# Altium project MPU-6050_Main_Project.PrjPcb
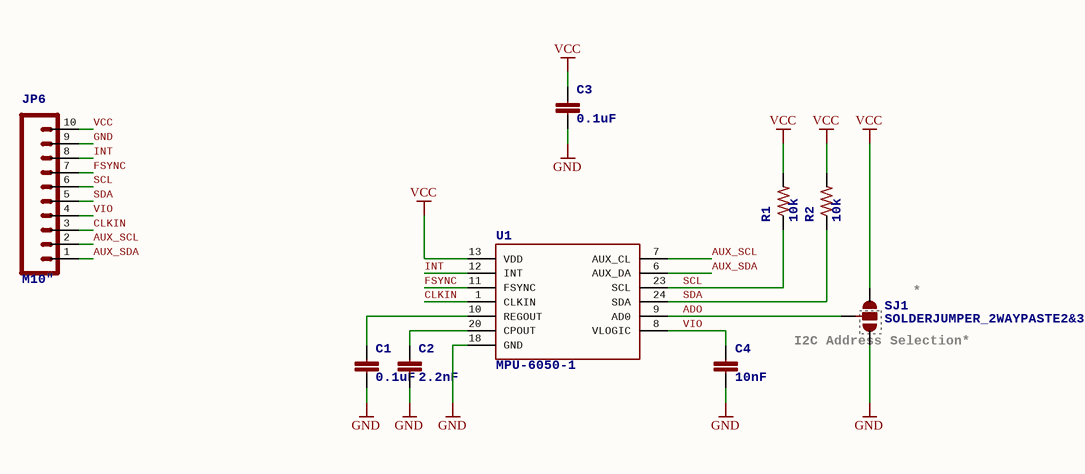
[diagram p0: MPU-6050_Main_SCH.SchDoc]
1 sheet, 9 parts. Net scope: global (net labels, ports and power ports of the same name join across sheets).
Board file: MPU-6050_Main_PCB.PcbDoc

## Sheet MPU-6050_Main_SCH.SchDoc: TITLE:
size A4; Date: Date:

### Parts
C1  >NAME: C1  [0603-CAP]  (hidden comment: 0.1uF)
C2  >NAME: C2  [0603-CAP]  (hidden comment: 2.2nF)
C3  >NAME: C3  [0603-CAP]  (hidden comment: 0.1uF)
C4  >NAME: C4  [0603-CAP]  (hidden comment: 10nF)
JP6  >NAME: JP6  [1X10]  (hidden comment: M10")
R1  >NAME: R1  [0603-RES]  (hidden comment: 10k)
R2  >NAME: R2  [0603-RES]  (hidden comment: 10k)
SJ1  >NAME: SJ1  [SJ_3_PASTE2&3]  (hidden comment: SOLDERJUMPER_2WAYPASTE2&3)
U1  >NAME: U1  [QFN-24-4MM2]  (hidden comment: MPU-6050-1)

### Nets
GND: C1.2 C2.2 C3.2 C4.2 JP6.9 SJ1.3 U1.18(GND)
VCC: C3.1 JP6.10 R1.2 R2.2 SJ1.1 U1.13(VDD)
ADO: SJ1.2 U1.9(AD0)
AUX_SCL: JP6.2 U1.7(AUX_CL)
AUX_SDA: JP6.1 U1.6(AUX_DA)
CLKIN: JP6.3 U1.1(CLKIN)
FSYNC: JP6.7 U1.11(FSYNC)
INT: JP6.8 U1.12(INT)
SCL: JP6.6 R1.1 U1.23(SCL)
SDA: JP6.5 R2.1 U1.24(SDA)
VIO: C4.1 JP6.4 U1.8(VLOGIC)
NetC1_1: C1.1 U1.10(REGOUT)
NetC2_1: C2.1 U1.20(CPOUT)

### Notes on the sheet
- (near SJ1) *
- (near SJ1) I2C Address Selection*
- Title
- Size:
- Date:
- A4
- Number:
- Time:
- Revision:
- Sheet
- of
- File:

### Library data of the parts
C1-C4 = CAP0603-CAP: <b>Capacitor</b> / Standard 0603 ceramic capacitor, and 0.1" leaded capacitor.
  C1 C3: >VALUE: 0.1uF
  C2: >VALUE: 2.2nF
  C4: >VALUE: 10nF
JP6 = M10": <b>Header 10</b> / Standard 10-pin 0.1" header. Use with straight break away headers (SKU : PRT-00116), right angle break away headers (PRT-00553), swiss pins (PRT-00743), machine pins (PRT-00117), and female headers (PRT-00115).; >VALUE: M10"
R1 R2 = RESISTOR0603-RES: <b>Resistor</b> / Basic schematic elements and footprints for 0603, 1206, and PTH resistors.; >VALUE: 10k
SJ1 = SOLDERJUMPER_2WAYPASTE2&3: <b>Solder Jumper</b> / 2 way solder jumper; >VALUE: SOLDERJUMPER_2WAYPASTE2&3
U1 = MPU-6050-1: >VALUE: MPU-6050-1